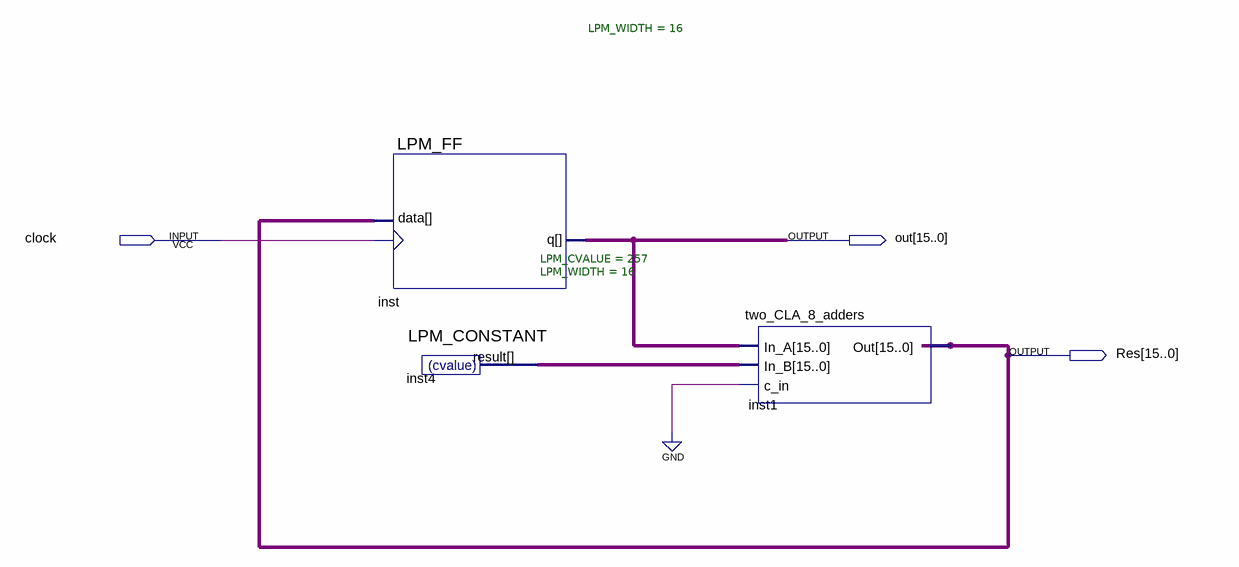
[diagram p0: schematic sheet]
// Quartus schematic test_Adder.bdf as structural Verilog: 3 symbols, 3 pins
module test_Adder (
  input  clock,
  output [15:0] out,
  output [15:0] Res
);

  wire [15:0] inst4_result;

  LPM_FF #(.LPM_WIDTH(16)) inst (.clock(clock), .data(Res), .q(out));
  LPM_CONSTANT #(.LPM_CVALUE(257), .LPM_WIDTH(16)) inst4 (.result(inst4_result));
  two_CLA_8_adders inst1 (.In_A(out), .In_B(inst4_result), .c_in(1'b0), .Out(Res));
endmodule
